# EAGLE design Temperatura y humedadALIM (EAGLE 7.6.0)
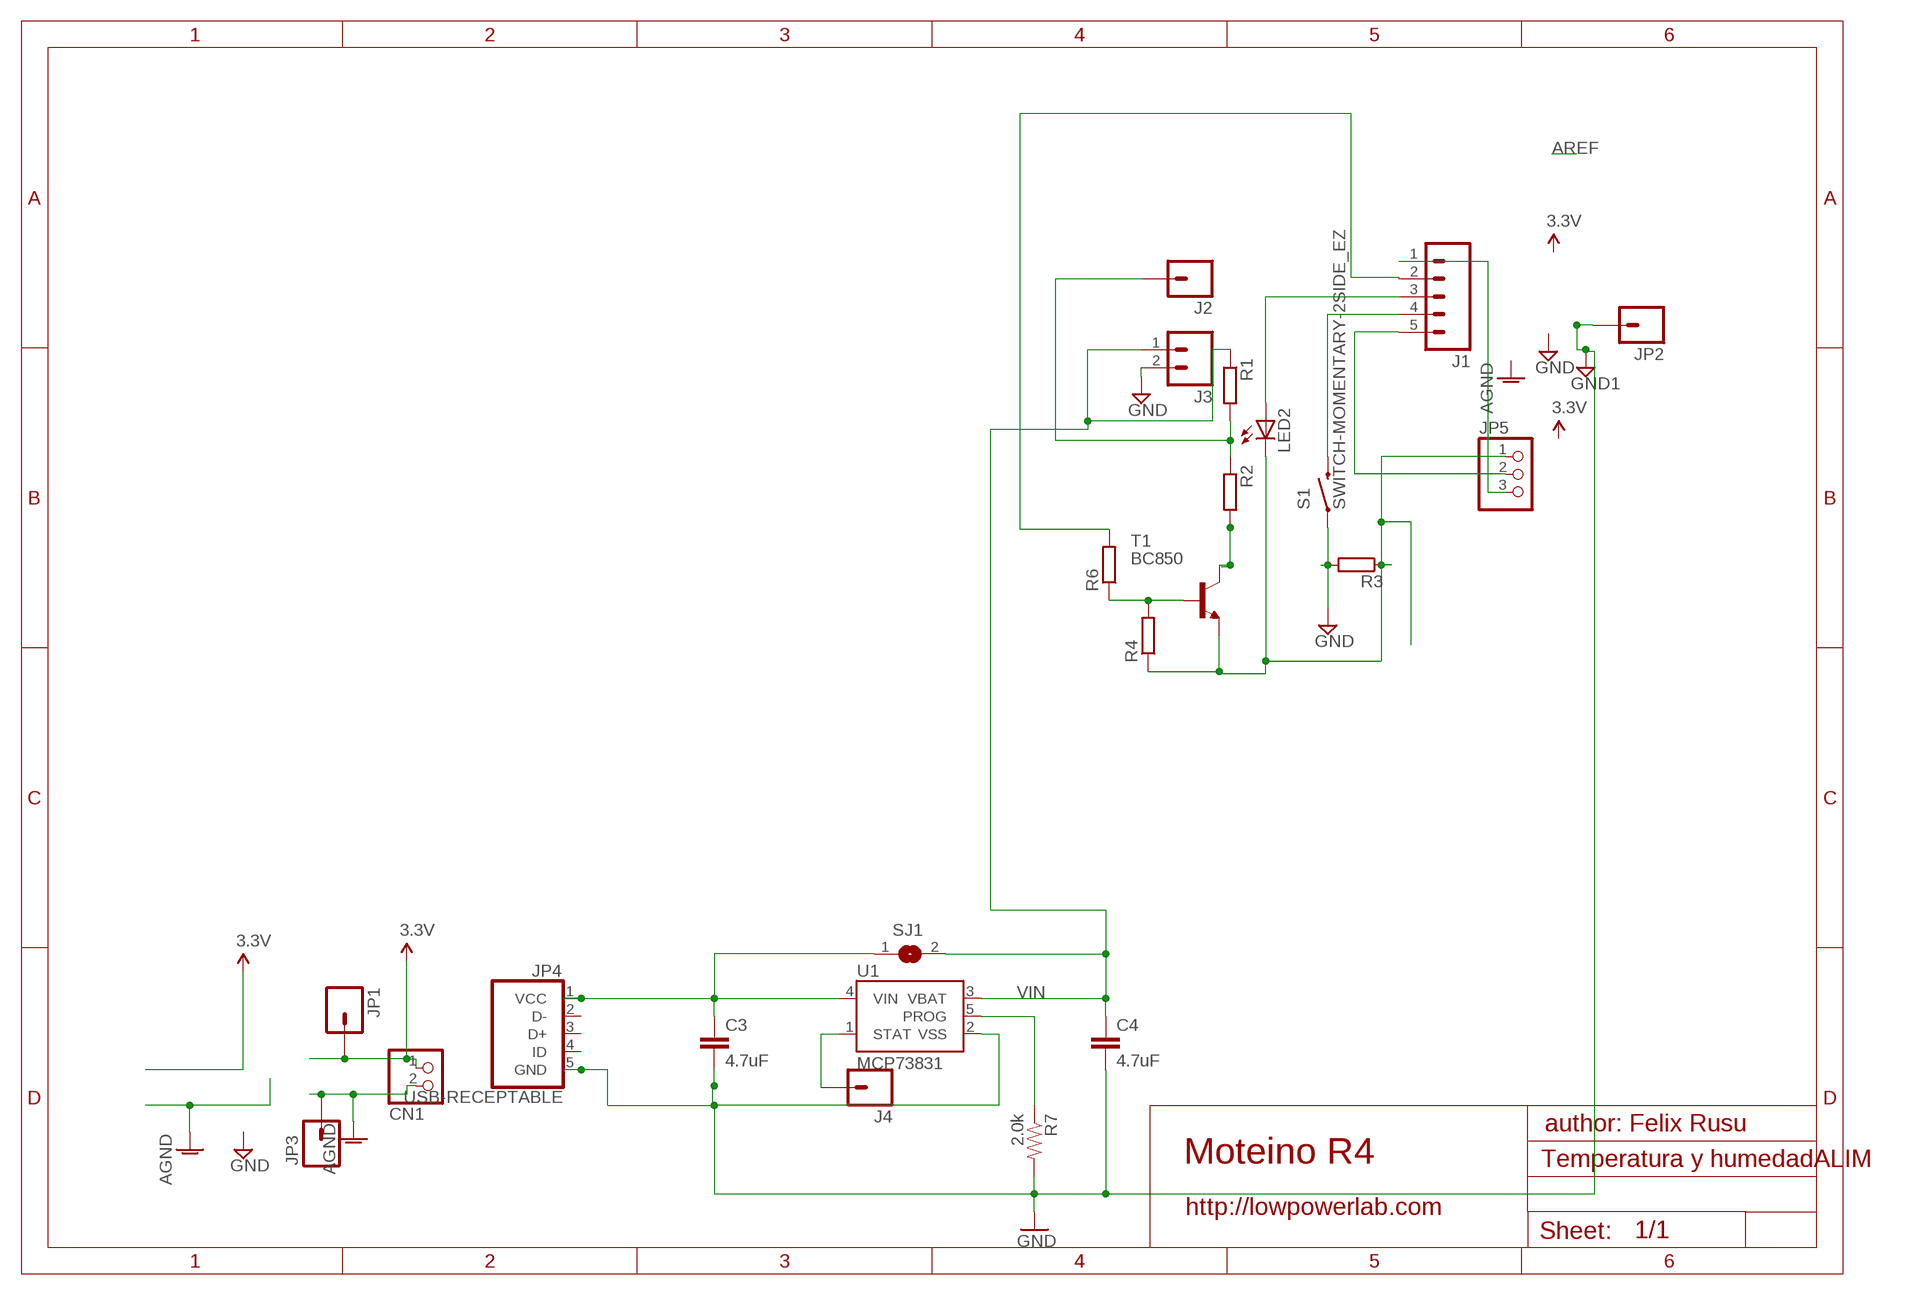
[diagram p0: schematic, sheet 1]

## Parts
C3  4.7uF  4.7UF-6.3V-10%(0603)0603  [0603-CAP]
C4  4.7uF  4.7UF-6.3V-10%(0603)0603  [0603-CAP]
CN1  JST_2PIN-SMT  [JST-PH-2-SMT]
J1  M05PTH  [1X05]
J2  M01PTH  [1X01]
J3  M02PTH  [1X02]
J4  M01PTH  [1X01]
JP1  M01PTH  [1X01]
JP2  M01PTH  [1X01]
JP3  M01PTH  [1X01]
JP4  USB-RECEPTABLE  [FCI-10103594-0001LF]
JP5  PINHD-1X3  [1X03]
LED2  LED3MM  [LED3MM]
R1  R-EU_0204/7  [0204/7]
R2  R-EU_0204/7  [0204/7]
R3  R-EU_M1206  [M1206]
R4  R-EU_M1206  [M1206]
R6  R-EU_M1206  [M1206]
R7  2.0k  2.0KOHM1/10W5%(0603)  [0603-RES]
S1  SWITCH-MOMENTARY-2SIDE_EZ  [TACTILE-PTH-SIDEEZ]
SJ1  SJ  [SJ]
T1  BC850  [SOT23]
U1  MCP73831  [SOT23-5]

## Nets
AGND [power]: CN1.2 JP3.1
GND [power]: J3.2 R3.2 S1.1
GND1 [power]: C3.2 C4.2 JP2.1 JP4.5(GND) R7.2 U1.2(VSS) ; supply symbol labelled GND
N$1: J1.4 S1.2
N$2: J1.5 JP5.2
N$3: J1.1 JP5.3
N$4 [power]: JP5.1 LED2.K(C) R3.1 R4.1 T1.2(E)
N$5: C3.1 JP4.1(VCC) SJ1.1 U1.4(VIN)
N$6: J2.1 R1.2 R2.1
N$7: R2.2 T1.3(C)
N$8: R4.2 R6.1 T1.1(B)
N$9: J1.2 R6.2
N$10: J1.3 LED2.A
N$11: J4.1 U1.1(STAT)
PROG: R7.1 U1.5(PROG)
VCC: CN1.1 JP1.1 ; supply symbol labelled 3.3V
VIN: C4.1 J3.1 R1.1 SJ1.2 U1.3(VBAT)
Unconnected: JP4.2(D-) JP4.3(D+) JP4.4(ID)

## Notes on the sheet
- author: Felix Rusu
- Moteino R4
- http://lowpowerlab.com

## Library data of the parts
C3 C4 = SparkFun-Capacitors:4.7UF-6.3V-10%(0603): CAP-08280; PROD_ID: CAP-08280
CN1 = adafruit:JST_2PIN: JST 2-Pin Connectors of various flavors SMT-RA (S2B-PH-SM4) 4UConnector #17311 SMT (B2B-PH-SM4) THM-RA (S2B-PH) THM (B2B-PH)
J1 = SparkFun-Connectors:M05: Header 5 Standard 5-pin 0.1" header. Use with straight break away headers (SKU : PRT-00116), right angle break away headers (PRT-00553), swiss pins (PRT-00743), machine pins (PRT-00117), and female headers (PRT-00115). Molex polarized connector foot print use with SKU : PRT-08230 with associated crimp pins and housings.
J2 J4 JP1-JP3 = SparkFun-Connectors:M01: Header 1 Standard 1-pin 0.1" header. Use with straight break away headers (SKU : PRT-00116), right angle break away headers (PRT-00553), swiss pins (PRT-00743), machine pins (PRT-00117), and female headers (PRT-00115). SMTSO-256-ET is a "flush mount" nut for a 4-40 screw. The older package used to be too tight, and did not allow it to sit properly thru the drill hit. The latest (0.165DIA) fits nice and snug.
J3 = SparkFun-Connectors:M02: Standard 2-pin 0.1" header. Use with - straight break away headers ( PRT-00116) - right angle break away headers (PRT-00553) - swiss pins (PRT-00743) - machine pins (PRT-00117) - female headers (PRT-00115) Molex polarized connector foot print use with: PRT-08233 with associated crimp pins and housings. 2.54_SCREWTERM for use with PRT-10571. 3.5mm Screw Terminal footprints for PRT-08084 5mm Screw Terminal footprints for use with PRT-08432
JP4 = daspilker:USB-RECEPTABLE: USB Receptable
JP5 = pinhead:PINHD-1X3: PIN HEADER
LED2 = led:LED: LED OSRAM: - CHIPLED LG R971, LG N971, LY N971, LG Q971, LY Q971, LO R971, LY R971 LH N974, LH R974 LS Q976, LO Q976, LY Q976 LO Q996 - Hyper CHIPLED LW Q18S LB Q993, LB Q99A, LB R99A - SideLED LS A670, LO A670, LY A670, LG A670, LP A670 LB A673, LV A673, LT A673, LW A673 LH A674 LY A675 LS A676, LA A676, LO A676, LY A676, LW A676 LS A679, LY A679, LG A679 - Hyper Micro SIDELED® LS Y876, LA Y876, LO Y876, LY Y876 LT Y87S - SmartLED LW L88C, LW L88S LB L89C, LB L89S, LG L890 LS L89K, LO L89K, LY L89K LS L896, LA L896, LO L896, LY L896 - TOPLED LS T670, LO T670, LY T670, LG T670, LP T670 LSG T670, LSP T670, LSY T670, LOP T670, LYG T670 LG T671, LOG T671, LSG T671 LB T673, LV T673, LT T673, LW T673 LH T674 LS T676, LA T676, LO T676, LY T676, LB T676, LH T676, LSB T676, LW T676 LB T67C, LV T67C, LT T67C, LS T67K, LO T67K, LY T67K, LW E67C LS E67B, LA E67B, LO E67B, LY E67B, LB E67C, LV E67C, LT E67C LW T67C LS T679, LY T679, LG T679 LS T770, LO T770, LY T770, LG T770, LP T770 LB T773, LV T773, LT T773, LW T773 LH T774 LS E675, LA E675, LY E675, LS T675 LS T776, LA T776, LO T776, LY T776, LB T776 LHGB T686 LT T68C, LB T68C - Hyper Mini TOPLED® LB M676 - Mini TOPLED Santana® LG M470 LS M47K, LO M47K, LY M47K Source: http://www.osram.convergy.de LUXEON: - LUMILED® LXK2-PW12-R00, LXK2-PW12-S00, LXK2-PW14-U00, LXK2-PW14-V00 LXK2-PM12-R00, LXK2-PM12-S00, LXK2-PM14-U00 LXK2-PE12-Q00, LXK2-PE12-R00, LXK2-PE12-S00, LXK2-PE14-T00, LXK2-PE14-U00 LXK2-PB12-K00, LXK2-PB12-L00, LXK2-PB12-M00, LXK2-PB14-N00, LXK2-PB14-P00, LXK2-PB14-Q00 LXK2-PR12-L00, LXK2-PR12-M00, LXK2-PR14-Q00, LXK2-PR14-R00 LXK2-PD12-Q00, LXK2-PD12-R00, LXK2-PD12-S00 LXK2-PH12-R00, LXK2-PH12-S00 LXK2-PL12-P00, LXK2-PL12-Q00, LXK2-PL12-R00 Source: www.luxeon.com KINGBRIGHT: KA-3528ASYC Source: www.kingbright.com
R1-R4 R6 = rcl:R-EU_: RESISTOR, European symbol
R7 = SparkFun-Resistors:2.0KOHM1/10W5%(0603): RES-08296; PROD_ID: RES-08296
S1 = SparkFun-Electromechanical:SWITCH-MOMENTARY-2: Various NO switches- pushbuttons, reed, etc
SJ1 = jumper:SJ: SMD solder JUMPER
T1 = transistor:BC850: NPN TRANSISTOR
U1 = SparkFun-PowerIC:MCP73831: Miniature single cell, fully integrated Li-Ion, Li-polymer charge management controller http://ww1.microchip.com/downloads/en/DeviceDoc/21984a.pdf IC-09995; PROD_ID: IC-09995

## Net classes
1 power: width 0.381 mm, clearance 0.254 mm

## Board
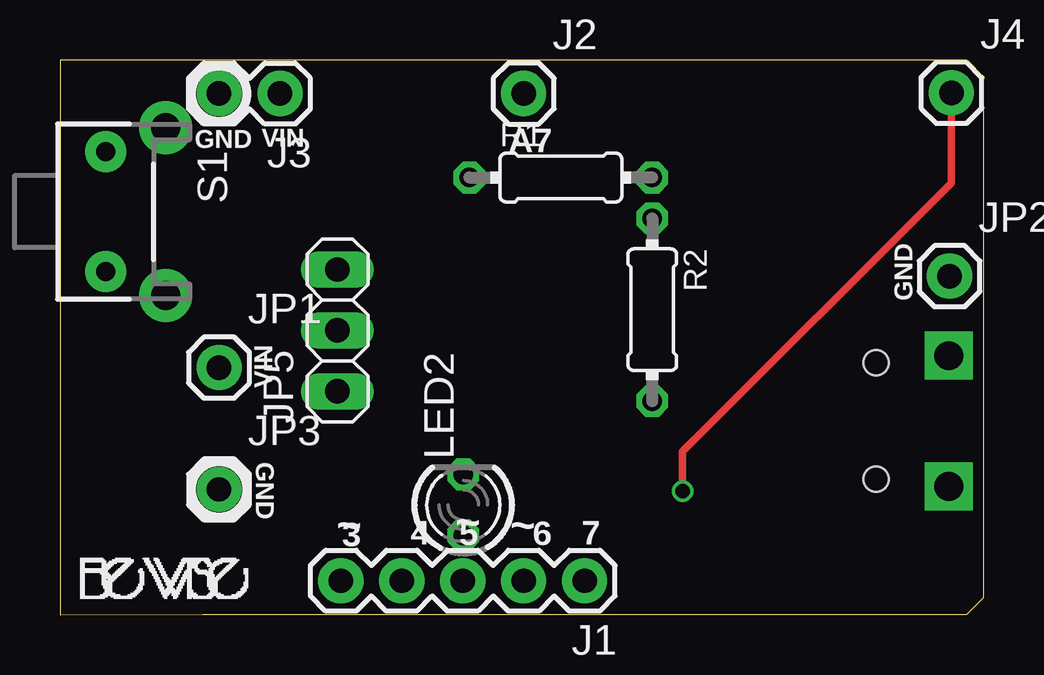
[diagram p1: board, top side]
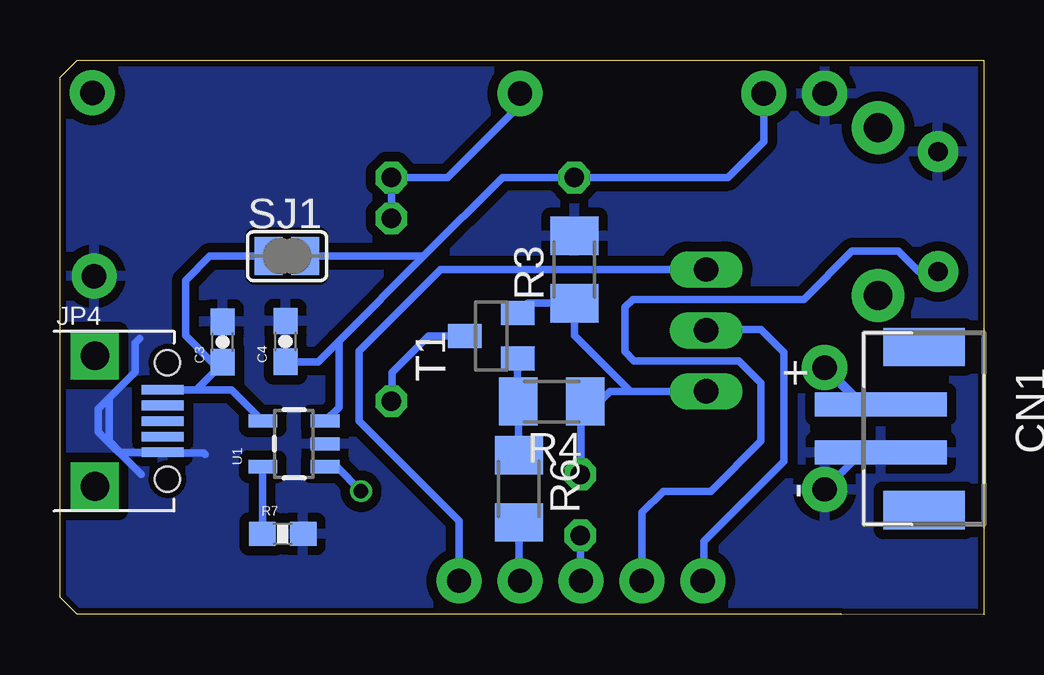
[diagram p2: board, bottom side, seen from below]

Size 38.51 x 23.14 mm. Coordinates in mm from the lower left corner, seen from the top.
Outline: 5.94,0.02 37.79,0.02 38.51,0.74 38.51,22.43 37.79,23.14 0,23.14 0,0 5.94,0.02
Copper layers (1*16): Top 0.035mm / dielectric 1.5mm / Bottom 0.035mm
Design rules "ITEADstudio_DRC *": minimum track width 6mil, minimum drill 12mil, track to track 16mil, track to pad 16mil, pad to pad 6mil, via to via 6mil, smd to smd 6mil, copper to edge 10mil, drill to drill 10mil, minimum pad ring 10mil, minimum via ring 6mil, stop-mask expansion 2mil, vias tented up to drill 100mil, thermal gap 15mil

### Footprints (pad centres in the part's own frame; a part is rotated, then mirrored left to right if it is on the bottom)
0603-CAP = smd 1.1 x 1: 1 -0.85,0; 2 0.85,0
JST-PH-2-SMT = smd 1 x 5.5: 1 -1,-1.8; 2 1,-1.8 | smd 1.6 x 3.4: NC1 -3.4,0; NC2 3.4,0
1X05 = drill 1.016 pad 1.88: 1 0,0; 2 2.54,0; 3 5.08,0; 4 7.62,0; 5 10.16,0
1X01 = drill 1.016 pad 1.88: 1 0,0
1X02 = drill 1.016 pad 1.88: 1 0,0; 2 2.54,0
FCI-10103594-0001LF = smd 0.4 x 1.75: 1 -1.3,4.525; 2 -0.65,4.525; 3 0,4.525; 4 0.65,4.525; 5 1.3,4.525 | drill 1.2 pad 2 square: P$3 -2.725,1.7; P$4 2.725,1.7 | hole 1.05: -2.425,4.73; 2.425,4.73
1X03 = drill 1.016 long: 1 -2.54,0; 2 0,0; 3 2.54,0
LED3MM = drill 0.813 octagon: A -1.27,0; K 1.27,0
0204/7 = drill 0.813 octagon: 1 -3.81,0; 2 3.81,0
M1206 = smd 1.6 x 2: 1 -1.4,0; 2 1.4,0
0603-RES = smd 1.1 x 1: 1 -0.85,0; 2 0.85,0
TACTILE-PTH-SIDEEZ = drill 0.8 pad 1.7: 1 -2.5,0; 2 2.5,0 | drill 1.2 pad 2.2: ANCHOR1 -3.5,2.5; ANCHOR2 3.5,2.5
SJ = smd 1.168 x 1.6: 1 -0.762,0; 2 0.762,0
SOT23 = smd 1 x 1.4: 1 -0.95,-1.1; 2 0.95,-1.1; 3 0,1.1
SOT23-5 = smd 0.55 x 1.2: 1 -0.95,-1.3; 2 0,-1.3; 3 0.95,-1.3; 4 0.95,1.3; 5 -0.95,1.3

### Placement (x,y rotation side)
C3  31.72,11.38 90 bottom
C4  29.11,11.4 90 bottom
CN1  2.49,7.77 270 bottom
J1  21.87,1.42 180 top
J2  19.33,21.74 0 top
J3  9.17,21.74 180 top
J4  37.16,21.77 0 top
JP1  6.63,10.31 0 top
JP2  37.08,14.12 0 top
JP3  6.63,5.23 0 top
JP4  38.75,8.08 270 bottom
JP5  11.57,11.86 90 top
LED2  16.81,4.58 90 top
R1  20.88,18.24 0 top
R2  24.69,12.73 270 top
R3  17.07,14.4 90 bottom
R4  18.01,8.89 180 bottom
R6  19.38,5.26 270 bottom
R7  29.22,3.37 0 bottom
S1  1.91,16.81 270 top
SJ1  29.04,14.96 0 bottom
T1  20.52,11.63 90 bottom
U1  28.75,7.13 90 bottom

### Tracks (layer width: path | path; a pad name or v marks a point on that pad's centre or on a via)
AGND
  Bottom 0.305: CN1.2 5.09,6.77 JP3.1
  pour Bottom: 4.98,22.94 38.35,22.94 38.38,0.23 0.2,0.18 0.2,22.96
GND
  pour Bottom: 0.15,22.99 38.3,22.89 38.3,0.25 0.18,0.2
GND1
  Bottom 0.305: JP4.5 35.99,6.78 36.46,7.26 36.46,9.04 35.38,10.12 | 35.38,10.12 | 35.38,10.12 36.9,8.59 36.9,7.64 35.12,5.86 | 35.12,5.86 | 35.12,5.86 36.01,6.75 | 32.45,6.68 32.51,6.75 33.85,6.75 | 35.38,10.12 35.38,11.33 35.19,11.52
  pour Bottom: 0.2,22.96 38.35,22.91 38.35,0.15 0.2,0.2
N$1
  Bottom 0.305: S1.2 2.71,14.31 3.56,15.16 5.49,15.16 7.49,13.16 14.63,13.16 14.96,12.83 14.96,10.97 14.58,10.59 10.2,10.59 9.28,9.67 9.28,7.26 11.38,5.16 13.35,5.16 14.24,4.27 14.24,2.88 14.25,2.87 J1.4
N$2
  Bottom 0.305: JP5.2 10.44,11.86 10.4,11.9 9.28,11.9 8.32,10.95 8.32,6.41 11.66,3.07 11.66,1.47 J1.5
N$3
  Bottom 0.305: JP5.3 22.63,14.4 26.03,11 26.03,8.08 21.87,3.91 J1.1 | 21.84,1.45 J1.1 | 21.87,1.91 J1.1
N$4
  Bottom 0.305: JP5.1 14.73,9.32 | 14.73,9.32 15.57,9.32 16.61,8.28 | LED2.K 16.79,5.94 16.79,8.1 16.61,8.28 | 14.73,9.32 17.07,11.66 R3.1 19,13 T1.2 | R4.1 16.61,8.28
N$5
  Bottom 0.305: C3.1 31.7,10.51 32.83,9.38 | 31.76,10.49 C3.1 | U1.4 31.35,9.38 32.83,9.38 | 32.83,9.38 JP4.1 | C3.1 32.16,10.53 33.28,11.65 33.28,13.94 32.26,14.96 SJ1.1
N$6
  Bottom 0.305: J2.1 19.33,21.26 22.35,18.24 R1.2 R2.1
N$7
  Bottom 0.305: T1.3 23.14,11.63 24.66,10.11 24.66,8.94 R2.2
N$8
  Bottom 0.305: T1.1 R4.2 R6.1
N$9
  Bottom 0.305: R6.2 19.38,1.47 J1.2
N$10
  Bottom 0.305: LED2.A J1.3
N$11  (via drill 0.6)
  Top 0.305: v25.96,5.16 25.96,6.81 37.16,18.01 J4.1 | J4.1
  Bottom 0.305: U1.1 26.98,6.18 v25.96,5.16
PROG
  Bottom 0.305: R7.1 30.07,6.17 U1.5
VCC
  Bottom 0.406: CN1.1 5.09,8.77 JP1.1
VIN
  Bottom 0.305: 29.07,10.52 C4.1 27.75,10.55 26.88,11.42 | J3.1 9.17,19.74 10.67,18.24 R1.1 20.07,18.24 23.35,14.96 | 29.49,14.71 SJ1.2 23.35,14.96 | 23.35,14.96 26.88,11.42 | U1.3 26.88,8.65 26.88,11.42

### Text on the board
_tsilk: GND | VIN | A7 | GND | VIN | GND | 3 | 4 | 5 | 6 | 7 | ~ | ~ | ~